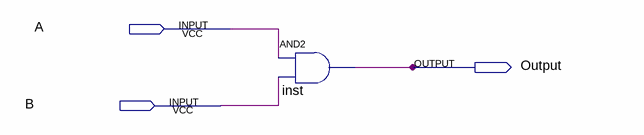
[diagram p0: schematic sheet]
// Quartus schematic d1.bdf as structural Verilog: 1 symbols, 3 pins
module d1 (
  input  A,
  input  B,
  output Output
);

  and inst (Output, A, B);
endmodule
